# EAGLE schematic untitled1 (EAGLE 9.6.2)
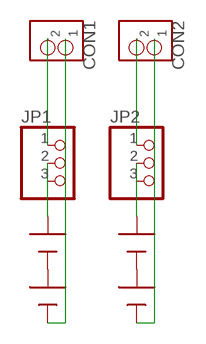
[diagram p0: schematic, sheet 1]

## Parts
CON1  B2B-XH-A  [B2B-XH-A]
CON2  B2B-XH-A  [B2B-XH-A]
JP1  PINHD-1X3  [1X03]
JP2  PINHD-1X3  [1X03]
U$1  CR123A  [CR123A]
U$2  CR123A  [CR123A]
U$3  CR123A  [CR123A]
U$4  CR123A  [CR123A]

## Nets
N$1: CON1.P$2 JP1.1
N$2: CON1.P$1 U$3.-
N$3: CON2.P$2 JP2.1
N$4: CON2.P$1 U$4.-
N$5: U$2.- U$4.+
N$6: JP1.2 JP1.3 U$1.+
N$7: U$1.- U$3.+
N$8: JP2.2 JP2.3 U$2.+

## Library data of the parts
CON1 CON2 = xh2-jst-con:B2B-XH-A
JP1 JP2 = pinhead:PINHD-1X3: PIN HEADER
U$1-U$4 = untitled:CR123A